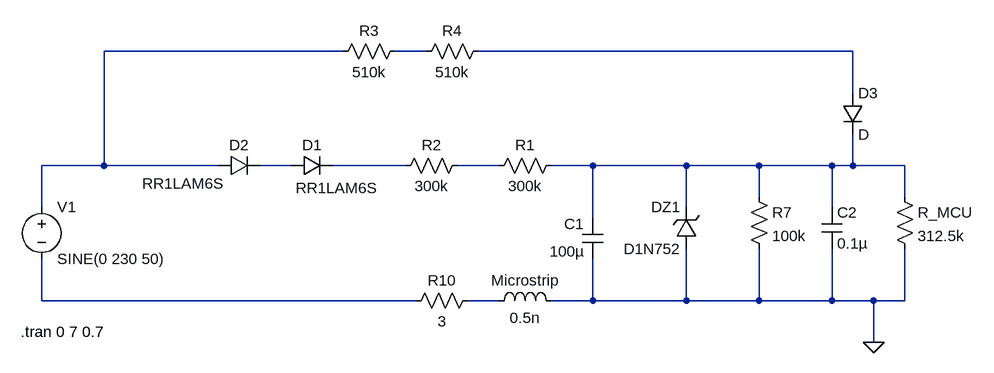
[diagram p0: schematic MainsACto5DC_schematics.asc]
MainsACto5DC_schematics.asc, the LTspice schematic file:
Version 4
SHEET 1 880 680
WIRE -112 -832 -480 -832
WIRE 16 -832 -32 -832
WIRE 672 -832 96 -832
WIRE 672 -768 672 -832
WIRE -480 -656 -480 -832
WIRE -480 -656 -576 -656
WIRE -304 -656 -480 -656
WIRE -192 -656 -240 -656
WIRE -16 -656 -128 -656
WIRE 128 -656 64 -656
WIRE 272 -656 208 -656
WIRE 416 -656 272 -656
WIRE 528 -656 416 -656
WIRE 640 -656 528 -656
WIRE 672 -656 672 -704
WIRE 672 -656 640 -656
WIRE 752 -656 672 -656
WIRE 528 -608 528 -656
WIRE 752 -608 752 -656
WIRE -576 -592 -576 -656
WIRE 416 -592 416 -656
WIRE 640 -592 640 -656
WIRE 272 -576 272 -656
WIRE -576 -448 -576 -512
WIRE 0 -448 -576 -448
WIRE 128 -448 80 -448
WIRE 272 -448 272 -512
WIRE 272 -448 208 -448
WIRE 416 -448 416 -528
WIRE 416 -448 272 -448
WIRE 528 -448 528 -528
WIRE 528 -448 416 -448
WIRE 640 -448 640 -528
WIRE 640 -448 528 -448
WIRE 704 -448 640 -448
WIRE 752 -448 752 -528
WIRE 752 -448 704 -448
WIRE 704 -384 704 -448
FLAG 704 -384 0
SYMBOL voltage -576 -608 R0
WINDOW 123 0 0 Left 0
WINDOW 39 0 0 Left 0
SYMATTR InstName V1
SYMATTR Value SINE(0 230 50)
SYMBOL diode -304 -640 R270
WINDOW 0 32 32 VTop 2
WINDOW 3 4 -54 VBottom 2
SYMATTR InstName D2
SYMATTR Value RR1LAM6S
SYMBOL diode -192 -640 R270
WINDOW 0 32 32 VTop 2
WINDOW 3 -3 70 VBottom 2
SYMATTR InstName D1
SYMATTR Value RR1LAM6S
SYMBOL res 96 -464 R90
WINDOW 0 0 56 VBottom 2
WINDOW 3 32 56 VTop 2
SYMATTR InstName R10
SYMATTR Value 3
SYMBOL res 80 -672 R90
WINDOW 0 0 56 VBottom 2
WINDOW 3 32 56 VTop 2
SYMATTR InstName R2
SYMATTR Value 300k
SYMBOL res 224 -672 R90
WINDOW 0 0 56 VBottom 2
WINDOW 3 32 56 VTop 2
SYMATTR InstName R1
SYMATTR Value 300k
SYMBOL ind 112 -432 R270
WINDOW 0 32 56 VTop 2
WINDOW 3 5 56 VBottom 2
SYMATTR InstName Microstrip
SYMATTR Value 0.5n
SYMBOL cap 256 -576 R0
WINDOW 0 -28 10 Left 2
WINDOW 3 -50 52 Left 2
SYMATTR InstName C1
SYMATTR Value 100µ
SYMATTR SpiceLine V=16
SYMBOL res 512 -624 R0
SYMATTR InstName R7
SYMATTR Value 100k
SYMBOL cap 624 -592 R0
SYMATTR InstName C2
SYMATTR Value 0.1µ
SYMBOL zener 432 -528 R180
WINDOW 0 24 64 Left 2
WINDOW 3 24 0 Left 2
SYMATTR InstName DZ1
SYMATTR Value D1N752
SYMBOL res -16 -848 R90
WINDOW 0 0 56 VBottom 2
WINDOW 3 32 56 VTop 2
SYMATTR InstName R3
SYMATTR Value 510k
SYMBOL res 112 -848 R90
WINDOW 0 0 56 VBottom 2
WINDOW 3 32 56 VTop 2
SYMATTR InstName R4
SYMATTR Value 510k
SYMBOL diode 656 -768 R0
SYMATTR InstName D3
SYMBOL res 736 -624 R0
SYMATTR InstName R_MCU
SYMATTR Value 312.5k
TEXT -608 -400 Left 2 !.tran 0 7 0.7

The netlist it stands for:
* MainsACto5DC_schematics.asc
V1 N001 N008 SINE(0 230 50)
D2 N001 N004 RR1LAM6S
D1 N004 N005 RR1LAM6S
R10 N009 N008 3
R2 N006 N005 300k
R1 N007 N006 300k
L§Microstrip N009 0 0.5n
C1 N007 0 100µ V=16
R7 N007 0 100k
C2 N007 0 0.1µ
DZ1 0 N007 D1N752
R3 N002 N001 510k
R4 N003 N002 510k
D3 N003 N007 D
R_MCU N007 0 312.5k
.model D D
.lib standard.dio
.tran 0 7 0.7
.backanno
.end